# Altium schematic sheet insulated_rectifier.SchDoc
size A4
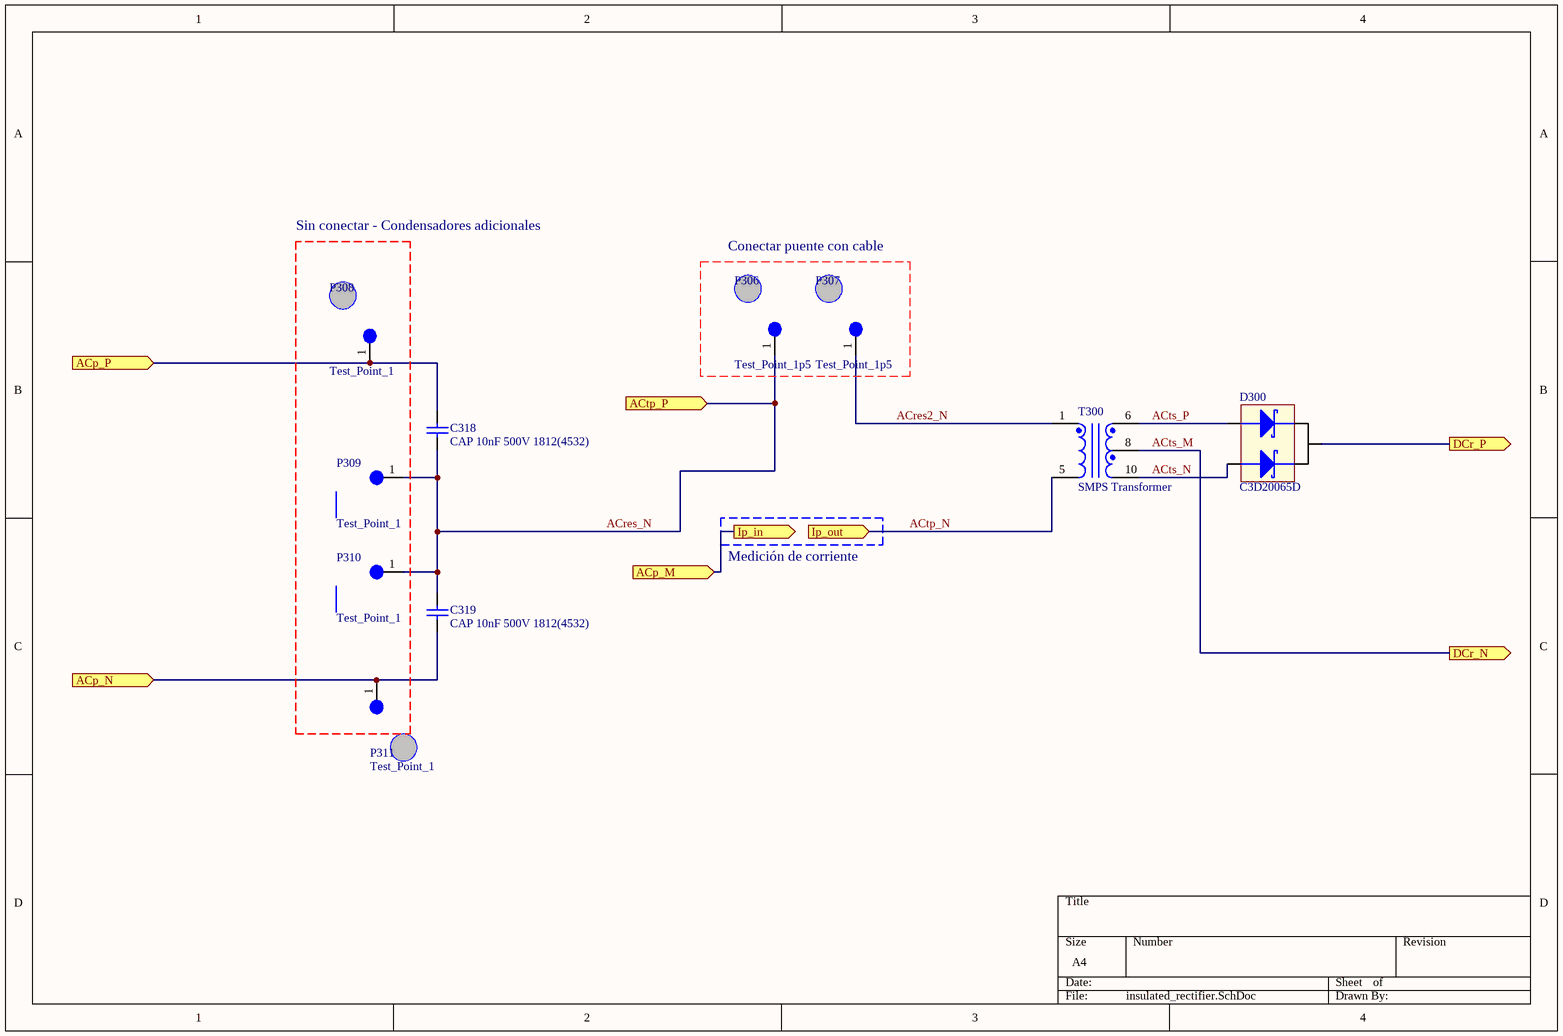
[diagram p0: insulated_rectifier.SchDoc]

## Parts
C318  CAP 10nF 500V 1812(4532)  [CAPC1812(4532)230_M]
C319  CAP 10nF 500V 1812(4532)  [CAPC1812(4532)230_M]
D300  C3D20065D  [TO-247-3_hsa]
P306  Test_Point_1p5  [_TP_1p5]
P307  Test_Point_1p5  [_TP_1p5]
P308  Test_Point_1  [_TP_1mm]
P309  Test_Point_1  [_TP_1mm]
P310  Test_Point_1  [_TP_1mm]
P311  Test_Point_1  [_TP_1mm]
T300  SMPS Transformer  [Payton_SMPS_trafo_61446]

## Blocks framed on the sheet
Sin conectar - Condensadores adicionales: P308-P311

## Ports
ACp_M (in), ACp_N (in), ACp_P (in), ACtp_P (in), DCr_N (out), DCr_P (out), Ip_in (out), Ip_out (in)

## Nets
ACp_M: port Ip_in, port ACp_M
ACp_N: C319.1 P311.1 ; port ACp_N
ACp_P: C318.2 P308.1 ; port ACp_P
ACres2_N: P307.1 T300.1
ACres_N: C318.1 C319.2 P306.1 P309.1 P310.1 ; port ACtp_P
ACtp_N: T300.5 ; port Ip_out
ACts_M: T300.8 ; port DCr_N
ACts_N: D300.3 T300.10
ACts_P: D300.1 T300.6
DCr_P: D300.2 ; port DCr_P

## Notes on the sheet
- Conectar puente con cable
- Medición de corriente

## Library data of the parts
C318 C319 = CMP-1040-00850-1: CAP 10nF 500V ±10% 1812 (4532 Metric) Thickness 2.3mm SMD; Case-EIA: 1812; Tolerance: Â±10%; Case-Metric: 4532; Max Thickness: 2.3 mm; Rated Voltage: 500 V; Technology: SMT; Value: 10nF
D300 = C3D20065D: Schottky Diodes & Rectifiers Schottky Diode 2X10A, 650V C3D20065D; Manufacturer: Cree; Element Configuration: Common Cathode; Forward Current: 55A; Supplier 2: Digi-Key; Manufacturer Part Number: C3D20065D; RoHS: Yes; Category: Rectifier Diodes; Stock 2: 143; Pricing 2: 1=10,17000, 100=8,47000, 500=7,26004, 1000=6,36001 (USD); Case/Package: TO-247; Number of Pins: 3; Max Repetitive Reverse Voltage (Vrrm): 650V; Packaging: Cut Tape; REACH SVHC: No SVHC; ComponentLink1URL: http://www.mouser.com/ds/2/90/3d20065d_silicon_carbide_schottky_diode_z_rec_rect-838556.pdf?src-supplier=Mouser; ComponentLink1Description: http://www.mouser.com/ds/2/90/3d20065d_silicon_carbide_schottky_diode_z_rec_rect-838556.pdf?src-supplier=Mouser; ComponentLink2URL: http://www.farnell.com/datasheets/1821848.pdf?src-supplier=Element14; ComponentLink2Description: http://www.farnell.com/datasheets/1821848.pdf?src-supplier=Element14; ComponentLink3URL: http://www.wolfspeed.com/media/downloads/102/C3D20065D.pdf?src-supplier=Digi-Key; ComponentLink3Description: http://www.wolfspeed.com/media/downloads/102/C3D20065D.pdf?src-supplier=Digi-Key; Supplier Part Number 2: C3D20065D-ND; Supplier 1: Mouser; Stock 1: 7; Pricing 1: 1 = 10.17000, 100 = 8.47000, 500 = 7.26000, 1000 = 6.36000 (USD); ComponentLink4URL: https://www.wolfspeed.com/downloads/dl/file/id/102/product/74/c3d20065d.pdf?src-supplier=Digi-Key; ComponentLink4Description: https://www.wolfspeed.com/downloads/dl/file/id/102/product/74/c3d20065d.pdf?src-supplier=Digi-Key; Supplier Part Number 1: 941-C3D20065D
P306 P307 = Test_Point_1p5: Test point 1.5mm
P308-P311 = Test_Point_1: Test point 1mm
T300 = Payton_SMPS_trafo_61446: 1400W SMPS Transformer Payton 61446; Generic Type: T250AC-24-18C; Total Output Power (after rectifier): 1400W (140 Vdc/ 10 Adc); Transformer Operating Frequency: 150 kHz; Topology: Half Bridge; Input Voltage: 750-1000 Vdc; Transformer Input Voltage: 374-499 Vdc; Operating duty cicle, max.: 1 (0,5*2); Operating Volt-second product, max.: 2500 (1250*2) V-usec.; Primary Current, max.: 4,07 Arms (4,2 Apeak); Pri. to half Sec. ratio (Sec current, max. - 7,07 Arms): 24:9; Dielectric Strength (Pri. to Sec.): 2000 Vrms; Dielectric Strength (Pri.+Sec. to Core): 500 Vdc; Estimated Power Losses: 15W; Estimated Hot Spot Temperature (With heatsink of 85°C max attached): 110 °C; Ambient Temperature Range: - 40 °C to 85°C; Mechanical Dimension - Length (For reference only): 67 mm.; Mechanical Dimension - Width (For reference only): 65 mm.; Mechanical Dimension - Height (For reference only): 32 mm.